# EAGLE design discrim (EAGLE 6.5.0)
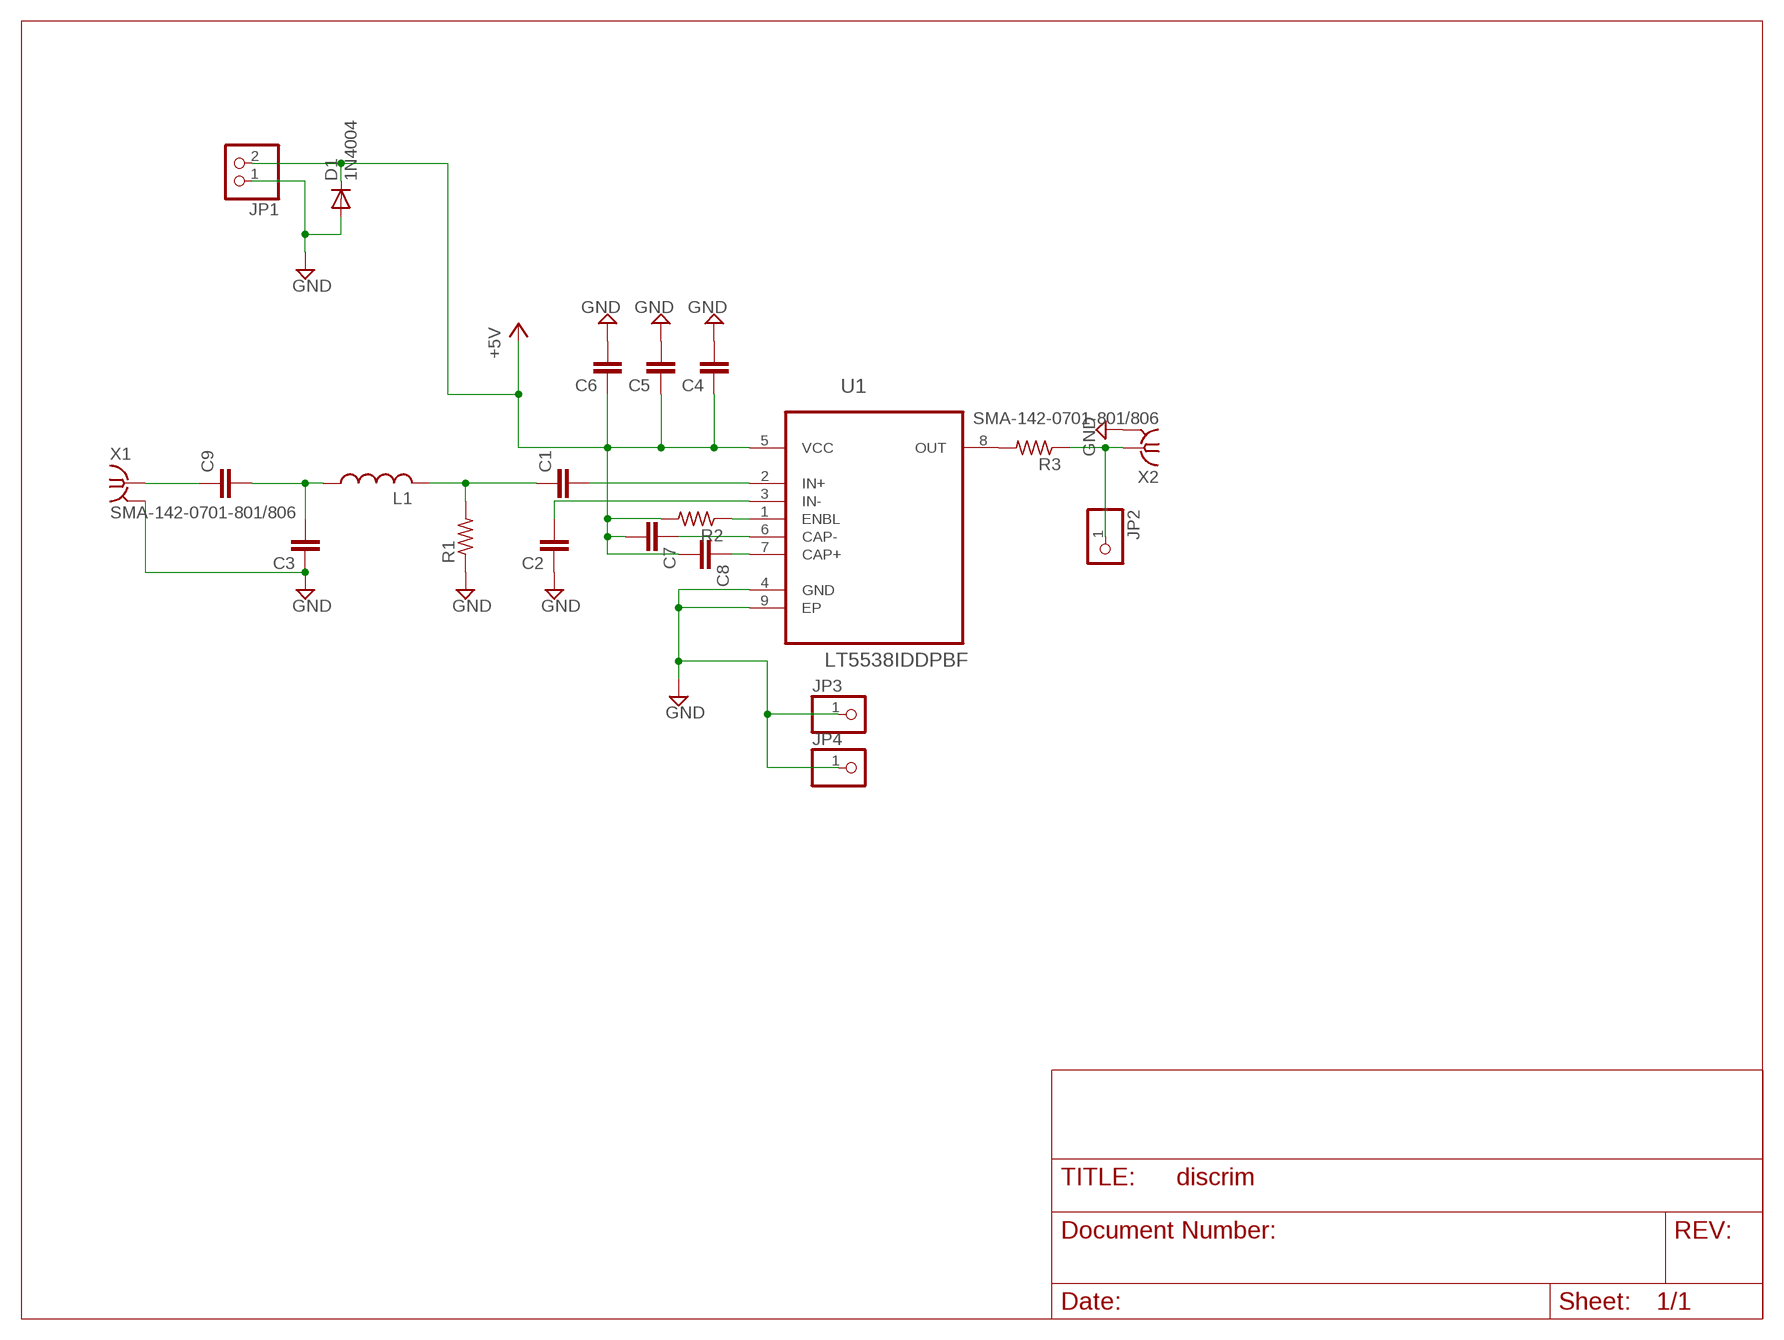
[diagram p0: schematic, sheet 1]

## Parts
C1  C-EUC0603  [C0603]
C2  C-EUC0603  [C0603]
C3  C-EUC0603  [C0603]
C4  C-EUC0603  [C0603]
C5  C-EUC0603  [C0603]
C6  C-EUC0603  [C0603]
C7  C-EUC0603  [C0603]
C8  C-EUC0603  [C0603]
C9  C-EUC0603  [C0603]
D1  1N4004  [DO41-10]
JP1  PINHD-1X2  [1X02]
JP2  PINHD-1X1  [1X01]
JP3  PINHD-1X1  [1X01]
JP4  PINHD-1X1  [1X01]
L1  L-USL2012C  [L2012C]
R1  R-US_R0603  [R0603]
R2  R-US_R0603  [R0603]
R3  R-US_R0603  [R0603]
U1  LT5538IDDPBF  [DFN300X300X80-9N]
X1  SMA-142-0701-801/806  [J502-ND-142-0701-801/806]
X2  SMA-142-0701-801/806  [J502-ND-142-0701-801/806]

## Nets
+5V: C4.1 C5.1 C6.1 C7.2 C8.2 D1.C JP1.2 R2.2 U1.5(VCC)
GND: C2.1 C3.1 C4.2 C5.2 C6.2 D1.A JP1.1 JP3.1 JP4.1 R1.1 U1.4(GND) U1.9(EP) X1.G@1 X1.G@2 X1.G@3 X1.G@4 X2.G@1 X2.G@2 X2.G@3 X2.G@4
N$1: C2.2 U1.3(IN-)
N$2: C1.2 U1.2(IN+)
N$3: C1.1 L1.2 R1.2
N$4: C3.2 C9.2 L1.1
N$5: C7.1 U1.6(CAP-)
N$6: C8.1 U1.7(CAP+)
N$7: C9.1 X1.1
N$8: R3.2 U1.8(OUT)
N$9: R2.1 U1.1(ENBL)
N$10: JP2.1 R3.1 X2.1

## Library data of the parts
C1-C9 = resistor:C-EU: CAPACITOR, European symbol
D1 = diode:1N4004: DIODE general purpose rectifier, 1 A
JP1 = pinhead:PINHD-1X2: PIN HEADER
JP2-JP4 = pinhead:PINHD-1X1: PIN HEADER
L1 = resistor:L-US: INDUCTOR, American symbol
R1-R3 = resistor:R-US_: RESISTOR, American symbol
U1 = LTC_By_element14_Batch_1:LT5538IDDPBF: 40MHz to 3.8GHz RF Power Detector with 75dB Dynamic Range; MPN: LT5538IDD#PBF; OC_FARNELL: 1692799; OC_NEWARK: 01N6455; PACKAGE: DFN-8; SUPPLIER: Linear Technology
X1 X2 = con-coax:SMA-: SMA 50 Ohm End Launch Jack Receptacle - Round Contact Johnson Components Source: www.johnsoncomponents.com .. J502-ND.pdf; MF: JOHNSON COMPONENTS; MPN: 142-0701-801; OC_FARNELL: 1608592; OC_NEWARK: 90F2624

## Board
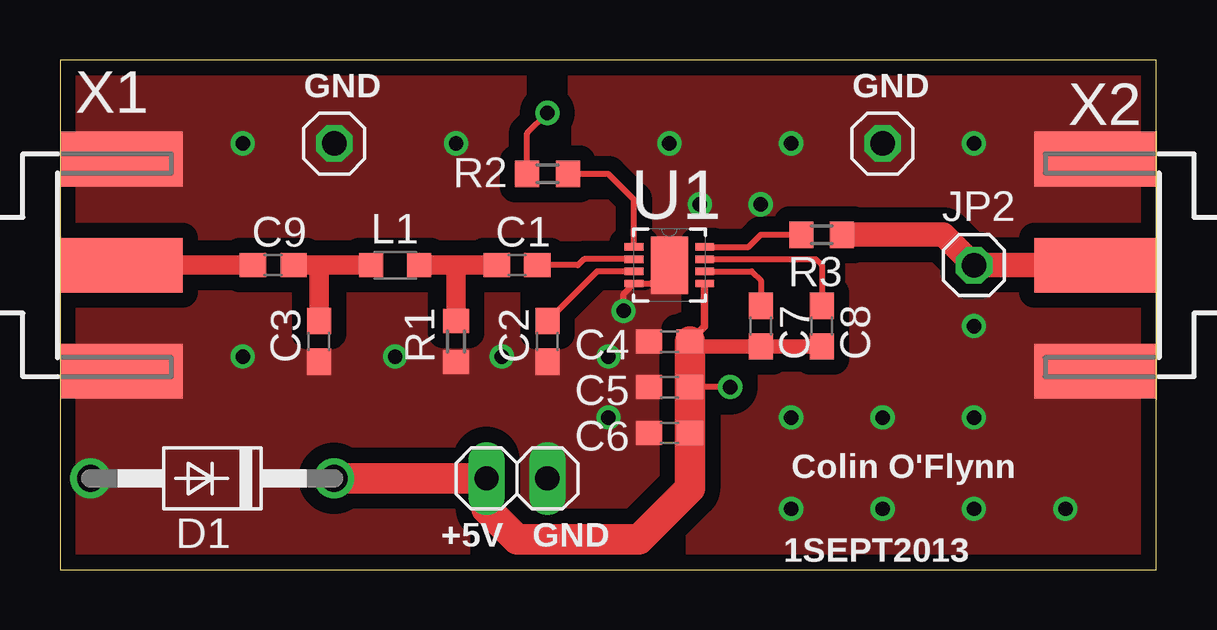
[diagram p1: board, top side]
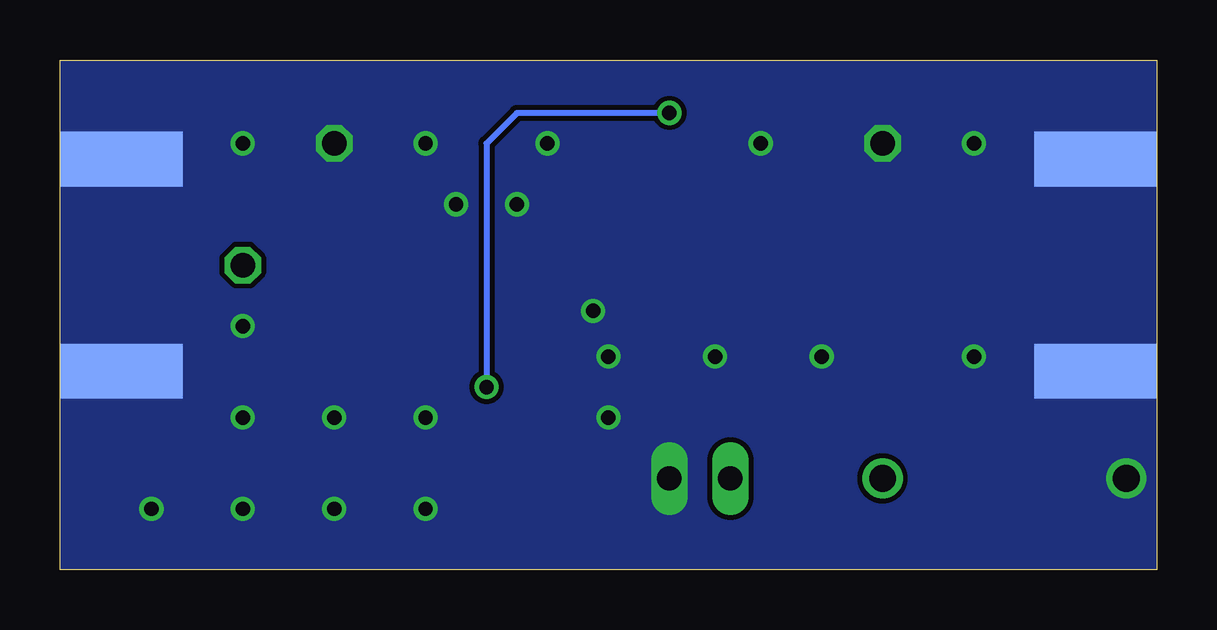
[diagram p2: board, bottom side, seen from below]

Size 45.72 x 21.26 mm. Coordinates in mm from the lower left corner, seen from the top.
Outline: 0,0 45.7,0 45.7,21.26 0,21.26 0,0
Copper layers (1*16): Top 0.035mm / dielectric 1.5mm / Bottom 0.035mm
Design rules "default *": minimum track width 10mil, minimum drill 24mil, track to track 8mil, track to pad 8mil, pad to pad 8mil, via to via 8mil, smd to smd 8mil, copper to edge 0.5mil, drill to drill 8mil, minimum pad ring 10mil, minimum via ring 8mil, stop-mask expansion 4mil, vias tented up to drill 0mil, thermal gap 10mil

### Footprints (pad centres in the part's own frame; a part is rotated, then mirrored left to right if it is on the bottom)
C0603 = smd 1.1 x 1: 1 -0.85,0; 2 0.85,0
DO41-10 = drill 1.118: A 5.08,0; C -5.08,0
1X02 = drill 1.016 long: 1 -1.27,0; 2 1.27,0
1X01 = drill 1.016 octagon: 1 0,0
L2012C = smd 1 x 1: 1 -1,0; 2 1,0
R0603 = smd 1 x 1.1: 1 -0.85,0; 2 0.85,0
DFN300X300X80-9N = smd 0.787 x 0.305: 1 -1.473,0.762; 2 -1.473,0.254; 3 -1.473,-0.254; 4 -1.473,-0.762; 5 1.473,-0.762; 6 1.473,-0.254; 7 1.473,0.254; 8 1.473,0.762 | smd 1.549 x 2.388: 9 0,0
J502-ND-142-0701-801/806 = smd 5.08 x 2.286: 1 2.565,0; G@1 2.565,4.42; G@2 2.565,-4.42 | smd 5.08 x 2.286 bottom: G@3 2.565,4.42; G@4 2.565,-4.42

### Placement (x,y rotation side)
C1  19.05,12.7 0 top
C2  20.32,9.52 90 top
C3  10.8,9.52 90 top
C4  25.4,9.52 180 top
C5  25.4,7.62 180 top
C6  25.4,5.72 180 top
C7  29.21,10.16 270 top
C8  31.75,10.16 270 top
C9  8.89,12.7 0 top
D1  6.35,3.81 180 top
JP1  19.05,3.81 180 top
JP2  38.1,12.7 0 top
JP3  11.43,17.78 0 top
JP4  34.29,17.78 0 top
L1  13.97,12.7 0 top
R1  16.51,9.52 90 top
R2  20.32,16.51 180 top
R3  31.75,13.97 180 top
U1  25.4,12.7 0 top
X1  0,12.7 0 top
X2  45.72,12.7 180 top

### Tracks (layer width: path | path; a pad name or v marks a point on that pad's centre or on a via)
+5V  (via drill 0.6)
  Top 0.254: R2.2 19.47,18.2 v20.32,19.05 | v27.94,7.62 C5.1
  Top 0.305: U1.5 26.87,10.15 C4.1
  Top 0.61: C8.2 C7.2 26.67,9.31 26.25,8.89
  Top 1.27: D1.C JP1.2 17.78,2.54 19.05,1.27 24.13,1.27 26.25,3.39 C6.1 C5.1 26.25,8.89 C4.1
  Bottom 0.254: v20.32,19.05 26.67,19.05 27.94,17.78 v27.94,7.62
GND  (via drill 0.6)
  Top 0.254: U1.9 24.64,11.94 U1.4 23.49,11.51 v23.49,10.8
  other vias: 30.48,2.54 34.29,2.54 38.1,2.54 41.91,2.54 38.1,6.35 34.29,6.35 30.48,6.35 38.1,10.16 38.1,17.78 30.48,17.78 25.4,17.78 16.51,17.78 7.62,17.78 7.62,8.89 13.97,8.89 18.41,8.89 22.86,8.89 22.86,6.35 29.21,15.24 26.67,15.24
  pour Bottom (no thermals): 0,21.59 45.72,21.59 45.72,0 0,0
  pour Top (isolate 0.635, no thermals): 0,21.59 45.72,21.59 45.72,0 0,0
N$1
  Top 0.254: U1.3 22.39,12.45 C2.2
N$2
  Top 0.254: U1.2 21.84,12.95 21.59,12.7 C1.2
N$3
  Top 0.813: L1.2 16.51,12.7 | 16.51,12.7 C1.1 | R1.2 16.51,12.7
N$4
  Top 0.813: C9.2 10.8,12.7 | 10.8,12.7 L1.1 | C3.2 10.8,12.7
N$5
  Top 0.254: U1.6 28.83,12.45 29.21,12.06 C7.1
N$6
  Top 0.254: U1.7 31.5,12.95 31.75,12.7 C8.1
N$7
  Top 0.813: X1.1 C9.1
N$8
  Top 0.254: U1.8 28.7,13.46 29.21,13.97 R3.2
N$9
  Top 0.254: U1.1 23.93,15.44 22.86,16.51 R2.1
N$10
  Top 1.016: X2.1 JP2.1 36.83,13.97 R3.1

### Text on the board
tPlace: GND | GND | Colin O'Flynn | +5V | GND | 1SEPT2013